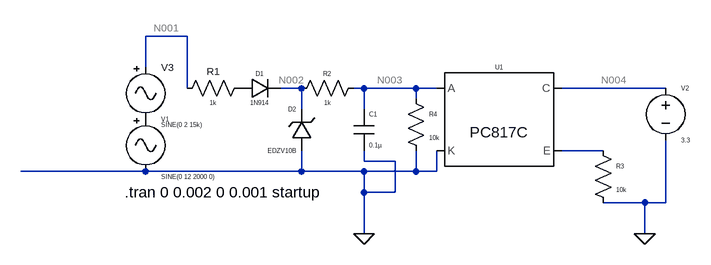
[diagram p0: schematic Alternator-rpm.asc]
Alternator-rpm.asc, the LTspice schematic file:
Version 4
SHEET 1 904 680
WIRE 96 -16 32 -16
WIRE 32 32 32 -16
WIRE 96 64 96 -16
WIRE 272 64 240 64
WIRE 368 64 352 64
WIRE 448 64 368 64
WIRE 480 64 448 64
WIRE 832 64 672 64
WIRE 448 80 448 64
WIRE 272 96 272 64
WIRE 368 96 368 64
WIRE 736 160 672 160
WIRE 368 176 368 160
WIRE 416 176 368 176
WIRE 32 192 -160 192
WIRE 272 192 272 160
WIRE 272 192 32 192
WIRE 368 192 272 192
WIRE 448 192 448 160
WIRE 448 192 368 192
WIRE 480 192 480 160
WIRE 480 192 448 192
WIRE 368 224 368 192
WIRE 416 224 416 176
WIRE 416 224 368 224
WIRE 800 240 736 240
WIRE 832 240 832 144
WIRE 832 240 800 240
WIRE 368 288 368 224
WIRE 800 288 800 240
FLAG 800 288 0
FLAG 368 288 0
SYMBOL Misc\\signal 32 96 R0
WINDOW 123 0 0 Left 0
WINDOW 39 0 0 Left 0
WINDOW 0 24 16 Left 0
WINDOW 3 24 104 Left 0
SYMATTR InstName V1
SYMATTR Value SINE(0 12 2000 0)
SYMBOL res 192 48 R90
WINDOW 0 0 56 VBottom 1
WINDOW 3 32 56 VTop 0
SYMATTR InstName R1
SYMATTR Value 1k
SYMATTR SpiceLine tol=1 pwr=0.1
SYMBOL cap 352 96 R0
WINDOW 0 24 8 Left 0
WINDOW 3 24 56 Left 0
SYMATTR InstName C1
SYMATTR Value 0.1µ
SYMATTR SpiceLine V=50v
SYMBOL diode 176 80 R270
WINDOW 0 32 32 VTop 0
WINDOW 3 0 32 VBottom 0
SYMATTR InstName D1
SYMATTR Value 1N914
SYMBOL zener 288 160 R180
WINDOW 0 24 64 Left 0
WINDOW 3 24 0 Left 0
SYMATTR InstName D2
SYMATTR Value EDZV10B
SYMBOL res 368 48 R90
WINDOW 0 0 56 VBottom 0
WINDOW 3 32 56 VTop 0
SYMATTR InstName R2
SYMATTR Value 1k
SYMBOL Optos\\PC817C 576 112 R0
WINDOW 0 0 -80 Center 0
SYMATTR InstName U1
SYMBOL voltage 832 48 R0
WINDOW 123 0 0 Left 0
WINDOW 39 0 0 Left 0
WINDOW 0 24 16 Left 0
WINDOW 3 24 96 Left 0
SYMATTR InstName V2
SYMATTR Value 3.3
SYMBOL res 720 144 R0
WINDOW 0 36 40 Left 0
WINDOW 3 36 76 Left 0
SYMATTR InstName R3
SYMATTR Value 10k
SYMBOL res 432 64 R0
WINDOW 0 36 40 Left 0
WINDOW 3 36 76 Left 0
SYMATTR InstName R4
SYMATTR Value 10k
SYMBOL Misc\\signal 32 16 R0
WINDOW 123 0 0 Left 0
WINDOW 39 0 0 Left 0
WINDOW 0 24 16 Left 1
WINDOW 3 24 104 Left 0
SYMATTR InstName V3
SYMATTR Value SINE(0 2 15k)
TEXT 0 224 Left 2 !.tran 0 0.002 0 0.001 startup

The netlist it stands for:
* Alternator-rpm.asc
V1 P001 0 SINE(0 12 2000 0)
R1 P002 N001 1k tol=1 pwr=0.1
C1 N003 0 0.1µ V=50v
D1 P002 N002 1N914
D2 0 N002 EDZV10B
R2 N003 N002 1k
XU1 N003 0 N004 N005 PC817 Igain=2.3m  ; PC817C, pins A K C E
V2 N004 0 3.3
R3 N005 0 10k
R4 N003 0 10k
V3 N001 P001 SINE(0 2 15k)
.model D D
.lib standard.dio
.tran 0 0.002 0 0.001 startup
.lib PC817.sub
.backanno
.end

* Results of the author's LTspice run, read from the files saved beside the schematic
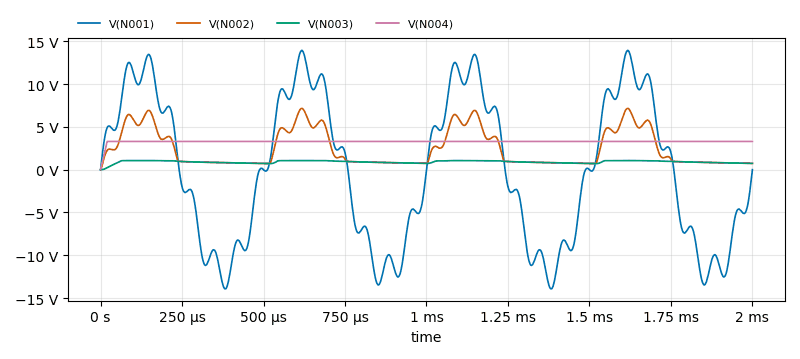
[diagram p1: Transient Analysis of Alternator-rpm.asc, plotted from the saved traces]
* Transient Analysis, 1 run:
*   V(N001): min -13.92 V, max 13.94 V, average 282.8 µV, rms 8.604 V, last 0 V
*   V(N002): min 0 V, max 7.166 V, average 2.439 V, rms 3.217 V, last 737.5 mV
*   V(N003): min 0 V, max 1.071 V, average 905.5 mV, rms 918.6 mV, last 736.4 mV
*   V(N004): min 0 V, max 3.3 V, average 3.283 V, rms 3.289 V, last 3.3 V